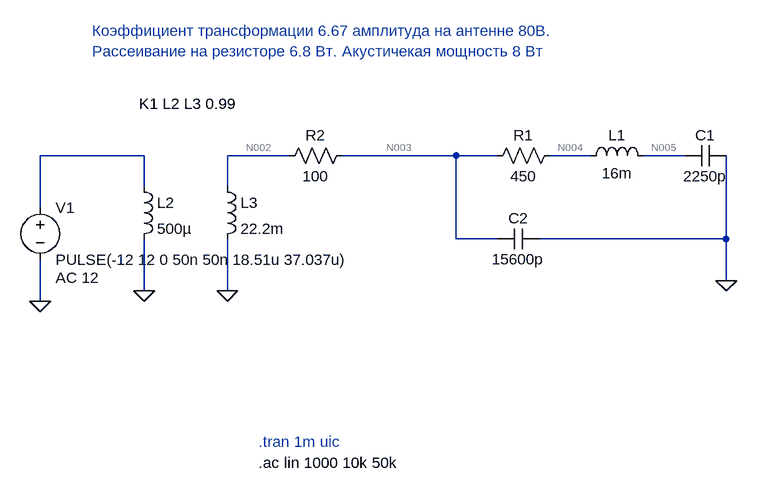
[diagram p0: schematic Power_amp_V1.asc]
Power_amp_V1.asc, the LTspice schematic file:
Version 4.1
SHEET 1 1104 680
WIRE -496 32 -656 32
WIRE -272 32 -368 32
WIRE -16 32 -192 32
WIRE 48 32 -16 32
WIRE 192 32 128 32
WIRE 336 32 272 32
WIRE -496 80 -496 32
WIRE -368 80 -368 32
WIRE -656 112 -656 32
WIRE -16 160 -16 32
WIRE 48 160 -16 160
WIRE 400 160 400 32
WIRE 400 160 112 160
WIRE 400 224 400 160
WIRE -496 240 -496 160
WIRE -368 240 -368 160
WIRE -656 256 -656 192
FLAG 400 224 0
FLAG -656 256 0
FLAG -496 240 0
FLAG -368 240 0
SYMBOL res 144 16 R90
WINDOW 0 0 56 VBottom 2
WINDOW 3 32 56 VTop 2
SYMATTR InstName R1
SYMATTR Value 450
SYMBOL ind 176 48 R270
WINDOW 0 32 56 VTop 2
WINDOW 3 5 56 VBottom 2
SYMATTR InstName L1
SYMATTR Value 16m
SYMATTR SpiceLine Rser=1m
SYMBOL cap 400 16 R90
WINDOW 0 0 32 VBottom 2
WINDOW 3 32 32 VTop 2
SYMATTR InstName C1
SYMATTR Value 2250p
SYMBOL cap 112 144 R90
WINDOW 0 0 32 VBottom 2
WINDOW 3 32 32 VTop 2
SYMATTR InstName C2
SYMATTR Value 15600p
SYMBOL voltage -656 96 R0
WINDOW 123 24 124 Left 2
WINDOW 39 0 0 Left 0
SYMATTR Value2 AC 12
SYMATTR InstName V1
SYMATTR Value PULSE(-12 12 0 50n 50n 18.51u 37.037u)
SYMBOL ind -512 64 R0
SYMATTR InstName L2
SYMATTR Value 500µ
SYMATTR Type ind
SYMATTR SpiceLine Rser=1m
SYMBOL ind -384 64 R0
SYMATTR InstName L3
SYMATTR Value 22.2m
SYMATTR Type ind
SYMATTR SpiceLine Rser=0.5
SYMBOL res -176 16 R90
WINDOW 0 0 56 VBottom 2
WINDOW 3 32 56 VTop 2
SYMATTR InstName R2
SYMATTR Value 100
TEXT -504 -48 Left 2 !K1 L2 L3 0.99
TEXT -320 472 Left 2 ;.tran 1m uic
TEXT -320 504 Left 2 !.ac lin 1000 10k 50k
TEXT -576 -160 Left 2 ;Коэффициент трансформации 6.67 амплитуда на антенне 80В. \nРассеивание на резисторе 6.8 Вт. Акустичекая мощность 8 Вт

The netlist it stands for:
* Power_amp_V1.asc
R1 N004 N003 450
L1 N004 N005 16m Rser=1m
C1 0 N005 2250p
C2 0 N003 15600p
V1 N001 0 PULSE(-12 12 0 50n 50n 18.51u 37.037u) AC 12
L2 N001 0 500µ Rser=1m
L3 N002 0 22.2m Rser=0.5
R2 N003 N002 100
K1 L2 L3 0.99
* .tran 1m uic
.ac lin 1000 10k 50k
* Коэффициент трансформации 6.67 амплитуда на антенне 80В.
* Рассеивание на резисторе 6.8 Вт. Акустичекая мощность 8 Вт
.backanno
.end

* Results of the author's LTspice run, read from the files saved beside the schematic
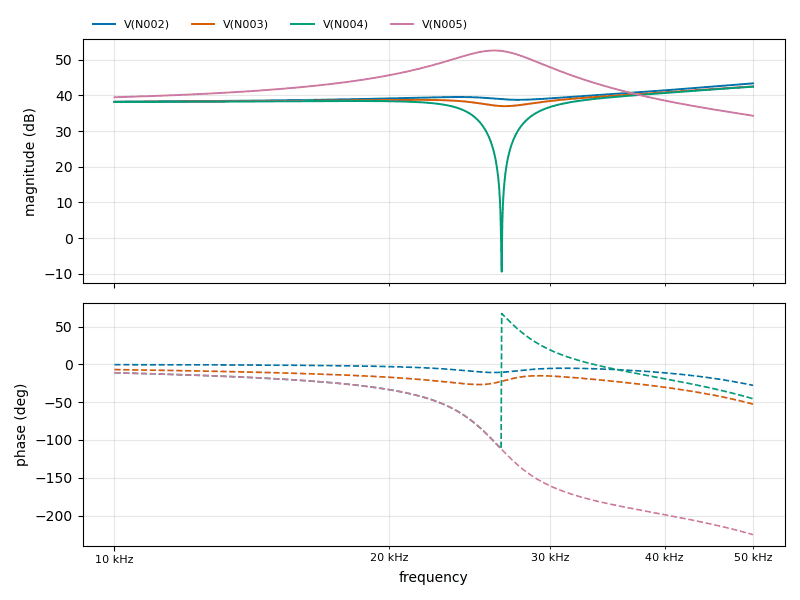
[diagram p1: AC Analysis of Power_amp_V1.asc, plotted from the saved traces]
* AC Analysis, 1 run:
*   V(N002): 38.25 dB at 10 kHz, 43.38 dB at 50 kHz, peak 43.38 dB at 50 kHz, 3 dB below the peak at 35.09 kHz
*   V(N003): 38.18 dB at 10 kHz, 42.51 dB at 50 kHz, peak 42.51 dB at 50 kHz, 3 dB below the peak at 33.36 kHz
*   V(N004): 38.15 dB at 10 kHz, 42.45 dB at 50 kHz, peak 42.45 dB at 50 kHz, 3 dB below the peak at 34.79 kHz
*   V(N005): 39.49 dB at 10 kHz, 34.31 dB at 50 kHz, peak 52.59 dB at 26.06 kHz, 3 dB below the peak at 23.09 kHz and 28.87 kHz